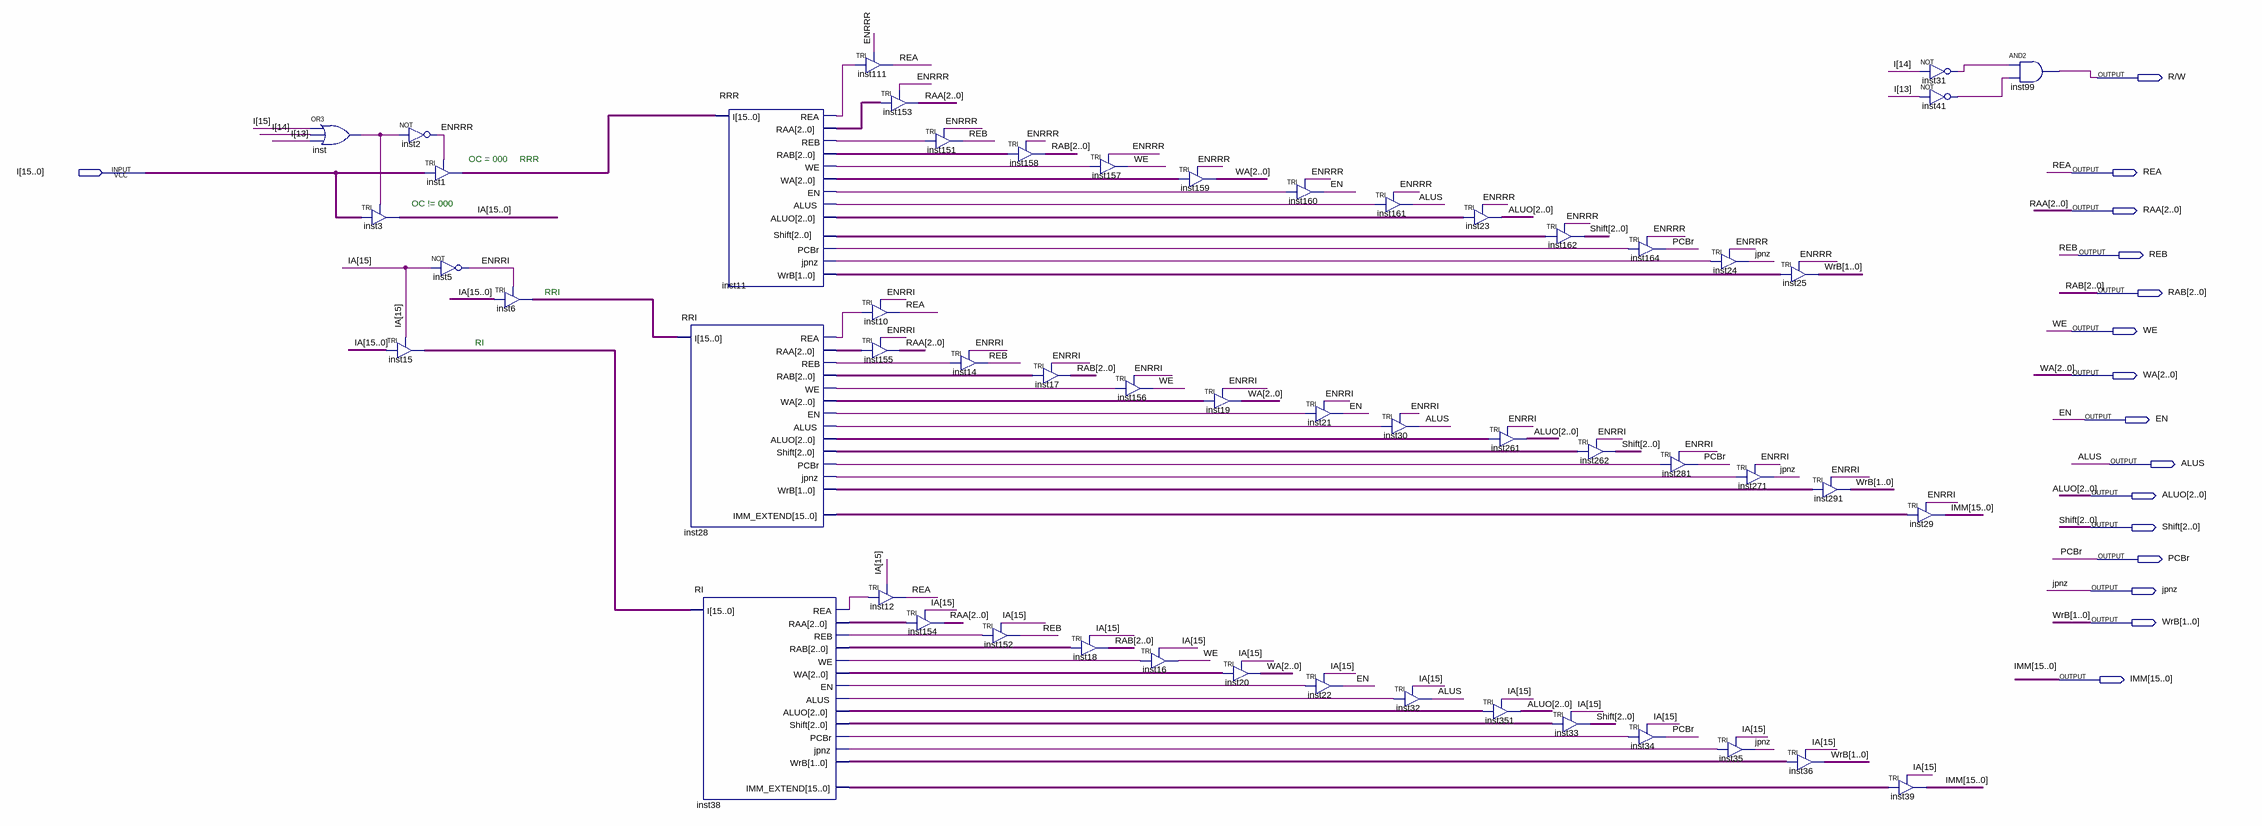
[diagram p0: schematic sheet]
// Quartus schematic DoAn.bdf as structural Verilog: 54 symbols, 16 pins
module DoAn (
  input  [15:0] I,
  output \R/W ,
  output REA,
  output [2:0] RAA,
  output REB,
  output [2:0] RAB,
  output WE,
  output [2:0] WA,
  output EN,
  output ALUS,
  output [2:0] ALUO,
  output [2:0] Shift,
  output PCBr,
  output jpnz,
  output [1:0] WrB,
  output [15:0] IMM
);

  wire ENRRI, ENRRR, inst11_alus, inst11_en, inst11_jpnz, inst11_pcbr, inst11_rea, inst11_reb, inst11_we,
       inst28_alus, inst28_en, inst28_jpnz, inst28_pcbr, inst28_rea, inst28_reb, inst28_we, inst31_out,
       inst38_alus, inst38_en, inst38_jpnz, inst38_pcbr, inst38_rea, inst38_reb, inst38_we, inst41_out,
       inst_out;
  wire [1:0] inst11_wrb, inst28_wrb, inst38_wrb;
  wire [2:0] inst11_aluo, inst11_raa, inst11_rab, inst11_shift, inst11_wa, inst28_aluo, inst28_raa,
       inst28_rab, inst28_shift, inst28_wa, inst38_aluo, inst38_raa, inst38_rab, inst38_shift, inst38_wa;
  wire [15:0] IA, inst1_out, inst6_out, inst15_out, inst28_imm_extend, inst38_imm_extend;

  or inst (inst_out, I[15], I[14], I[13]);
  TRI inst3[15:0] (.IN(I), .OE(inst_out), .OUT(IA));
  TRI inst15[15:0] (.IN(IA), .OE(IA[15]), .OUT(inst15_out));
  not inst2 (ENRRR, inst_out);
  TRI inst1[15:0] (.IN(I), .OE(ENRRR), .OUT(inst1_out));
  not inst5 (ENRRI, IA[15]);
  TRI inst6[15:0] (.IN(IA), .OE(ENRRI), .OUT(inst6_out));
  RRI inst28 (
    .I(inst6_out), .REA(inst28_rea), .REB(inst28_reb), .RAA(inst28_raa), .RAB(inst28_rab), .WE(inst28_we),
    .WA(inst28_wa), .EN(inst28_en), .ALUS(inst28_alus), .ALUO(inst28_aluo), .Shift(inst28_shift),
    .PCBr(inst28_pcbr), .jpnz(inst28_jpnz), .WrB(inst28_wrb), .IMM_EXTEND(inst28_imm_extend));
  RI inst38 (
    .I(inst15_out), .RAA(inst38_raa), .RAB(inst38_rab), .REA(inst38_rea), .REB(inst38_reb), .WE(inst38_we),
    .WA(inst38_wa), .EN(inst38_en), .ALUS(inst38_alus), .ALUO(inst38_aluo), .Shift(inst38_shift),
    .PCBr(inst38_pcbr), .jpnz(inst38_jpnz), .WrB(inst38_wrb), .IMM_EXTEND(inst38_imm_extend));
  RRR inst11 (
    .I(inst1_out), .REA(inst11_rea), .RAA(inst11_raa), .REB(inst11_reb), .RAB(inst11_rab), .WE(inst11_we),
    .WA(inst11_wa), .EN(inst11_en), .ALUS(inst11_alus), .ALUO(inst11_aluo), .PCBr(inst11_pcbr),
    .jpnz(inst11_jpnz), .WrB(inst11_wrb), .Shift(inst11_shift));
  TRI inst111 (.IN(inst11_rea), .OE(ENRRR), .OUT(REA));
  TRI inst153[2:0] (.IN(inst11_raa), .OE(ENRRR), .OUT(RAA));
  TRI inst10 (.IN(inst28_rea), .OE(ENRRI), .OUT(REA));
  TRI inst155[2:0] (.IN(inst28_raa), .OE(ENRRI), .OUT(RAA));
  TRI inst12 (.IN(inst38_rea), .OE(IA[15]), .OUT(REA));
  TRI inst151 (.IN(inst11_reb), .OE(ENRRR), .OUT(REB));
  TRI inst154[2:0] (.IN(inst38_raa), .OE(IA[15]), .OUT(RAA));
  TRI inst14 (.IN(inst28_reb), .OE(ENRRI), .OUT(REB));
  TRI inst152 (.IN(inst38_reb), .OE(IA[15]), .OUT(REB));
  TRI inst158[2:0] (.IN(inst11_rab), .OE(ENRRR), .OUT(RAB));
  TRI inst17[2:0] (.IN(inst28_rab), .OE(ENRRI), .OUT(RAB));
  TRI inst157 (.IN(inst11_we), .OE(ENRRR), .OUT(WE));
  TRI inst18[2:0] (.IN(inst38_rab), .OE(IA[15]), .OUT(RAB));
  TRI inst156 (.IN(inst28_we), .OE(ENRRI), .OUT(WE));
  TRI inst16 (.IN(inst38_we), .OE(IA[15]), .OUT(WE));
  TRI inst159[2:0] (.IN(inst11_wa), .OE(ENRRR), .OUT(WA));
  TRI inst19[2:0] (.IN(inst28_wa), .OE(ENRRI), .OUT(WA));
  TRI inst20[2:0] (.IN(inst38_wa), .OE(IA[15]), .OUT(WA));
  TRI inst160 (.IN(inst11_en), .OE(ENRRR), .OUT(EN));
  TRI inst21 (.IN(inst28_en), .OE(ENRRI), .OUT(EN));
  TRI inst22 (.IN(inst38_en), .OE(IA[15]), .OUT(EN));
  TRI inst161 (.IN(inst11_alus), .OE(ENRRR), .OUT(ALUS));
  TRI inst30 (.IN(inst28_alus), .OE(ENRRI), .OUT(ALUS));
  TRI inst32 (.IN(inst38_alus), .OE(IA[15]), .OUT(ALUS));
  TRI inst23[2:0] (.IN(inst11_aluo), .OE(ENRRR), .OUT(ALUO));
  TRI inst261[2:0] (.IN(inst28_aluo), .OE(ENRRI), .OUT(ALUO));
  TRI inst351[2:0] (.IN(inst38_aluo), .OE(IA[15]), .OUT(ALUO));
  TRI inst162[2:0] (.IN(inst11_shift), .OE(ENRRR), .OUT(Shift));
  TRI inst33[2:0] (.IN(inst38_shift), .OE(IA[15]), .OUT(Shift));
  TRI inst262[2:0] (.IN(inst28_shift), .OE(ENRRI), .OUT(Shift));
  TRI inst164 (.IN(inst11_pcbr), .OE(ENRRR), .OUT(PCBr));
  TRI inst34 (.IN(inst38_pcbr), .OE(IA[15]), .OUT(PCBr));
  TRI inst281 (.IN(inst28_pcbr), .OE(ENRRI), .OUT(PCBr));
  TRI inst24 (.IN(inst11_jpnz), .OE(ENRRR), .OUT(jpnz));
  TRI inst271 (.IN(inst28_jpnz), .OE(ENRRI), .OUT(jpnz));
  TRI inst35 (.IN(inst38_jpnz), .OE(IA[15]), .OUT(jpnz));
  TRI inst25[1:0] (.IN(inst11_wrb), .OE(ENRRR), .OUT(WrB));
  TRI inst36[1:0] (.IN(inst38_wrb), .OE(IA[15]), .OUT(WrB));
  TRI inst291[1:0] (.IN(inst28_wrb), .OE(ENRRI), .OUT(WrB));
  TRI inst29[15:0] (.IN(inst28_imm_extend), .OE(ENRRI), .OUT(IMM));
  TRI inst39[15:0] (.IN(inst38_imm_extend), .OE(IA[15]), .OUT(IMM));
  not inst31 (inst31_out, I[14]);
  not inst41 (inst41_out, I[13]);
  and inst99 (\R/W , inst31_out, inst41_out);

  // Notes on the sheet:
  //   OC = 000
  //   RRR
  //   OC != 000
  //   RRI
  //   RI
endmodule
